# Altium schematic sheet [08] - PERIPHERALS C.SchDoc: Test title
size A4; Date: YYYY-MM-DD; Engineer: X; SheetNumber: 8; Size: A4
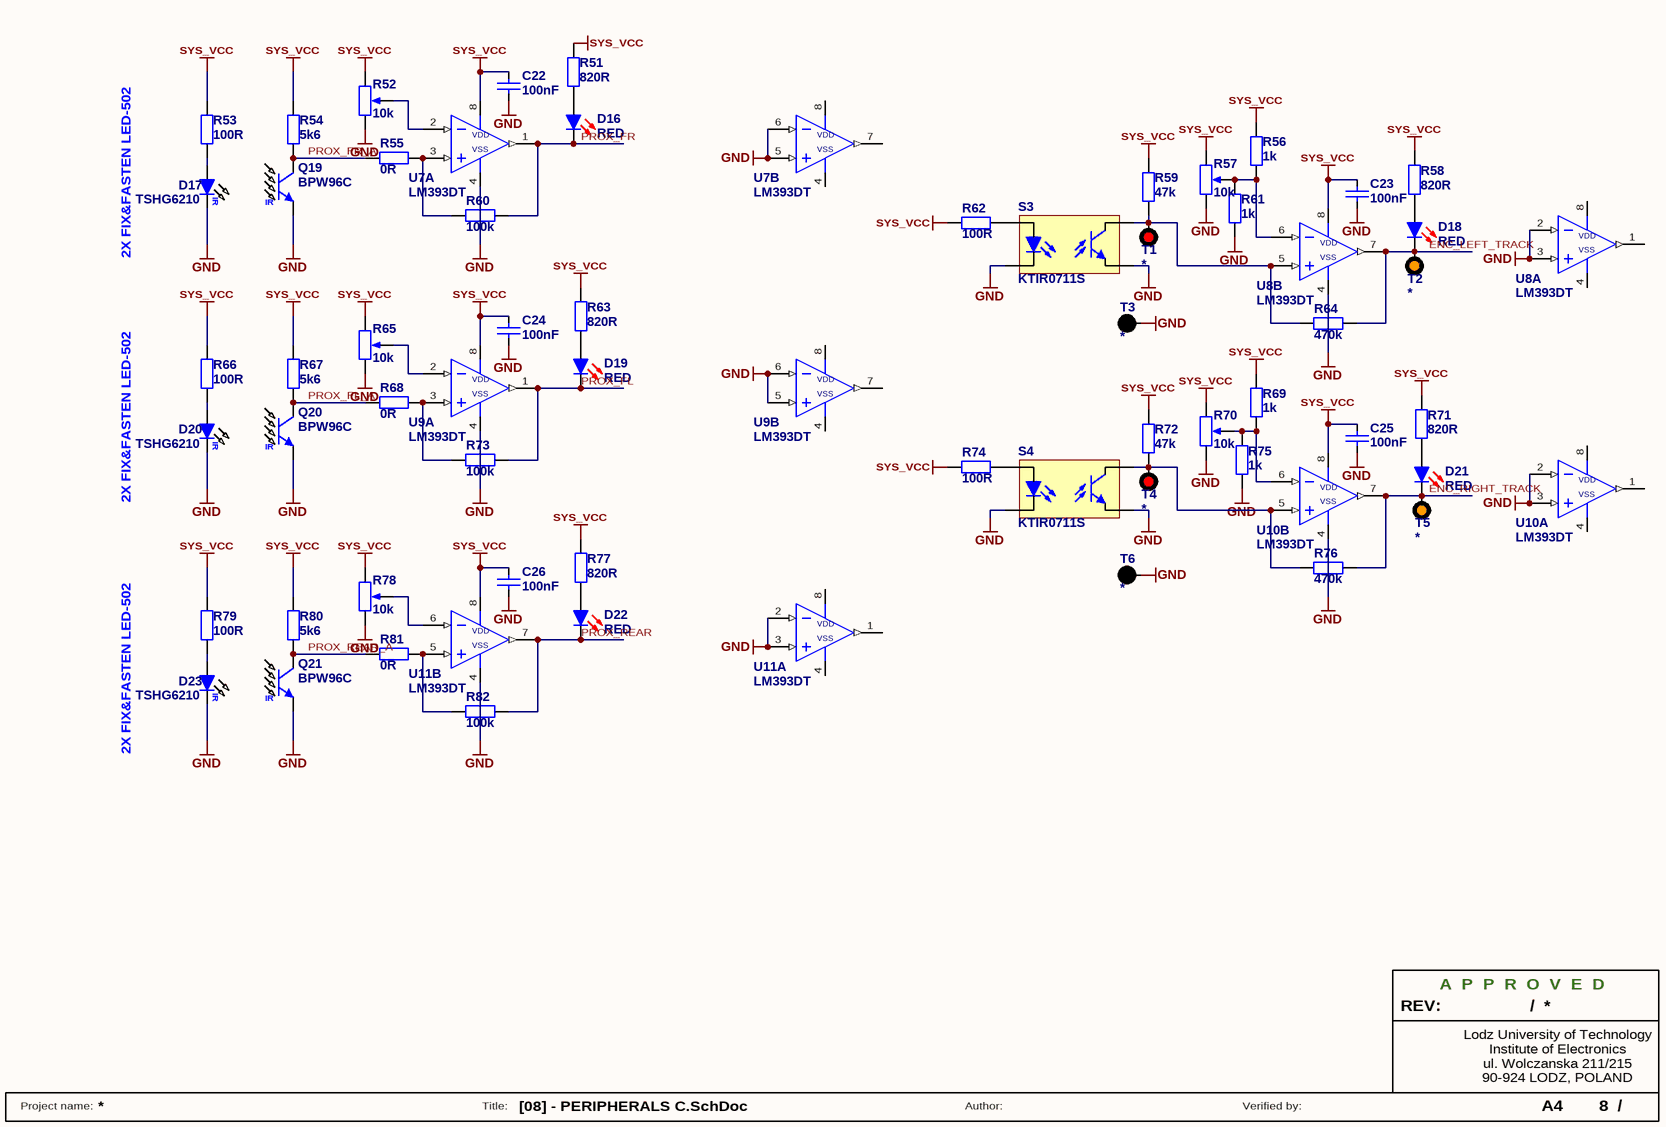
[diagram p0: [08] - PERIPHERALS C.SchDoc]

## Parts
C22  100nF  [C0805]
C23  100nF  [C0805]
C24  100nF  [C0805]
C25  100nF  [C0805]
C26  100nF  [C0805]
D16  RED  [LED0805R]
D17  TSHG6210  [LED-502]
D18  RED  [LED0805R]
D19  RED  [LED0805R]
D20  TSHG6210  [LED-502]
D21  RED  [LED0805R]
D22  RED  [LED0805R]
D23  TSHG6210  [LED-502]
Q19  BPW96C  [LED-502]
Q20  BPW96C  [LED-502]
Q21  BPW96C  [LED-502]
R51  820R  [R0805]
R52  value 10k  [3305SMD]  (hidden comment: *)
R53  100R  [R0805]
R54  5k6  [R0805]
R55  0R  [R0805]
R56  1k  [R0805]
R57  value 10k  [3305SMD]  (hidden comment: *)
R58  820R  [R0805]
R59  47k  [R0805]
R60  100k  [R0805]
R61  1k  [R0805]
R62  100R  [R0805]
R63  820R  [R0805]
R64  470k  [R0805]
R65  value 10k  [3305SMD]  (hidden comment: *)
R66  100R  [R0805]
R67  5k6  [R0805]
R68  0R  [R0805]
R69  1k  [R0805]
R70  value 10k  [3305SMD]  (hidden comment: *)
R71  820R  [R0805]
R72  47k  [R0805]
R73  100k  [R0805]
R74  100R  [R0805]
R75  1k  [R0805]
R76  470k  [R0805]
R77  820R  [R0805]
R78  value 10k  [3305SMD]  (hidden comment: *)
R79  100R  [R0805]
R80  5k6  [R0805]
R81  0R  [R0805]
R82  100k  [R0805]
S3  KTIR0711S  [KTIR0711S_wide_pads]
S4  KTIR0711S  [KTIR0711S_wide_pads]
T1  *  [Keystone_5000_RED]
T2  *  [Keystone_5003_ORANGE]
T3  *  [Keystone_5001_BLACK]
T4  *  [Keystone_5000_RED]
T5  *  [Keystone_5003_ORANGE]
T6  *  [Keystone_5001_BLACK]
U7  LM393DT  [SO8]  (parts A,B of 2)
U8  LM393DT  [SO8]  (parts A,B of 2)
U9  LM393DT  [SO8]  (parts A,B of 2)
U10  LM393DT  [SO8]  (parts A,B of 2)
U11  LM393DT  [SO8]  (parts A,B of 2)

## Nets
GND: C22.2 C23.2 C24.2 C25.2 C26.2 D17.2(K) D20.2(K) D23.2(K) Q19.1(E) Q20.1(E) Q21.1(E) R52.2(BOT) R57.2(BOT) R61.2 R65.2(BOT) R70.2(BOT) R75.2 R78.2(BOT) S3.2(E) S3.4(K) S4.2(E) S4.4(K) T3.0 T6.0 U7.4(GND) U7.5(IN+) U7.6(IN-) U8.2(IN-) U8.3(IN+) U8.4(GND) U9.4(GND) U9.5(IN+) U9.6(IN-) U10.2(IN-) U10.3(IN+) U10.4(GND) U11.2(IN-) U11.3(IN+) U11.4(GND)
SYS_VCC: C22.1 C23.1 C24.1 C25.1 C26.1 R51.1 R52.1(TOP) R53.1 R54.1 R56.1 R57.1(TOP) R58.1 R59.2 R62.2 R63.1 R65.1(TOP) R66.1 R67.1 R69.1 R70.1(TOP) R71.1 R72.2 R74.2 R77.1 R78.1(TOP) R79.1 R80.1 U7.8(V+) U8.8(V+) U9.8(V+) U10.8(V+) U11.8(V+)
ENC_LEFT_TRACK: D18.2(K) R64.2 T2.0 U8.7(OUT)
ENC_RIGHT_TRACK: D21.2(K) R76.2 T5.0 U10.7(OUT)
PROX_FL: D19.2(K) R73.2 U9.1(OUT)
PROX_FL_A: Q20.2(C) R67.2 R68.1
PROX_FR: D16.2(K) R60.2 U7.1(OUT)
PROX_FR_A: Q19.2(C) R54.2 R55.1
PROX_REAR: D22.2(K) R82.2 U11.7(OUT)
PROX_REAR_A: Q21.2(C) R80.2 R81.1
NetD16_1: D16.1(A) R51.2
NetD17_1: D17.1(A) R53.2
NetD18_1: D18.1(A) R58.2
NetD19_1: D19.1(A) R63.2
NetD20_1: D20.1(A) R66.2
NetD21_1: D21.1(A) R71.2
NetD22_1: D22.1(A) R77.2
NetD23_1: D23.1(A) R79.2
NetR52_3: R52.3(TAP) U7.2(IN-)
NetR55_2: R55.2 R60.1 U7.3(IN+)
NetR56_2: R56.2 R57.3(TAP) R61.1 U8.6(IN-)
NetR59_1: R59.1 R64.1 S3.3(C) T1.0 U8.5(IN+)
NetR62_1: R62.1 S3.1(A)
NetR65_3: R65.3(TAP) U9.2(IN-)
NetR68_2: R68.2 R73.1 U9.3(IN+)
NetR69_2: R69.2 R70.3(TAP) R75.1 U10.6(IN-)
NetR72_1: R72.1 R76.1 S4.3(C) T4.0 U10.5(IN+)
NetR74_1: R74.1 S4.1(A)
NetR78_3: R78.3(TAP) U11.6(IN-)
NetR81_2: R81.2 R82.1 U11.5(IN+)

Not connected (* = marked no-connect by the designer): U7 7(OUT); U8 1(OUT); U9 7(OUT); U10 1(OUT); U11 1(OUT)

## Notes on the sheet
- 2X FIX&FASTEN LED-502
- REV:
- A  P  P  R  O  V  E  D
- /
- Lodz University of Technology
- ul. Wolczanska 211/215
- 90-924 LODZ, POLAND
- Institute of Electronics
- Project name:
- Title:
- Author:
- Verified by:
- (in symbol BPW96C) IR
- (in symbol LM393DT, part A) VDD; VSS
- (in symbol LM393DT, part B) VDD; VSS
- (in symbol TSHG6210) IR

## Library data of the parts
C22-C26 = Cap: Capacitor; ComponentLink1Description: datasheet; ComponentLink2Description: supplier; Value: 100nF
D16 D18 D19 D21 D22 = LED_RED: RED LED; Published: 04-Apr-2006
D17 D20 D23 = TSHG6210: IR transmitter; 5mm; 850nm; transparent; 230mW; 10°; THT; 1.5÷1.8V; Published: 04-Apr-2006
Q19-Q21 = BPW96C: Phototransistor; λp max:850nm; 70V; 20°; Lens: transparent; Ø:5mm; Supplier 1: TME; Supplier Part Number 1: ELPT15-21C
R51 R53-R56 R58-R64 R66-R69 R71-R77 R79-R82 = Res: Resistor; Published: 19-Feb-2006; ComponentLink1Description: datasheet; ComponentLink2Description: supplier
  R51 R58 R63 R71 R77: Value: 820R
  R53 R62 R66 R74 R79: Value: 100R
  R54 R67 R80: Value: 5k6
  R55 R68 R81: Value: 0R
  R56 R61 R69 R75: Value: 1k
  R59 R72: Value: 47k
  R60 R73 R82: Value: 100k
  R64 R76: Value: 470k
R52 R57 R65 R70 R78 = 3305SMD-10K: Published: 21-10-2009; ComponentLink1Description: datasheet; ComponentLink2Description: supplier
S3 S4 = KTIR0711S: SUBMINIATURE, HIGH SENSITIVITY PHOTOINTERRUPTER
T1 T4 = Keystone 5000 Test Point: Keystone 5000 Test Point (RED)
T2 T5 = Keystone 5003 Test Point: Keystone 5003 Test Point (ORANGE)
T3 T6 = Keystone 5001 Test Point: Keystone 5001 Test Point (BLACK)
U7-U11 = LM393DT: Low power dual voltage comparators; Published: 03-Apr-2006